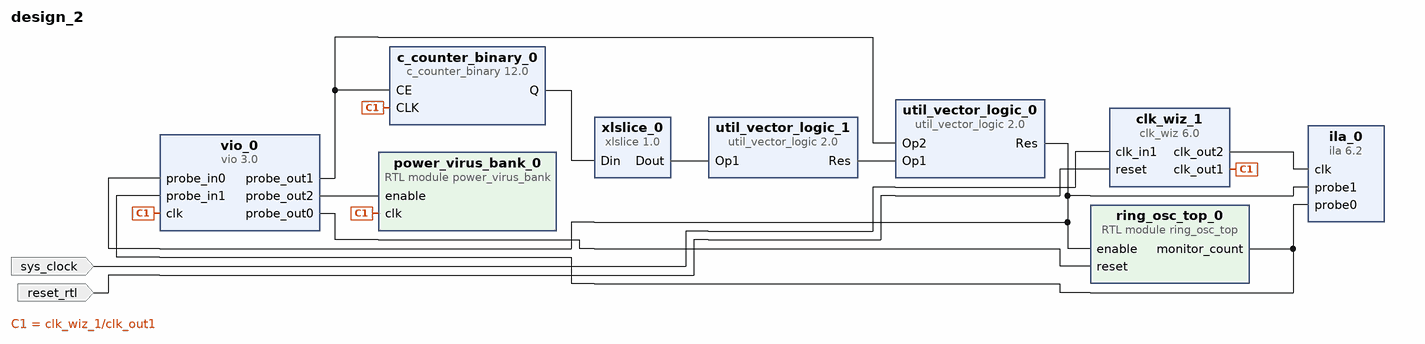
[diagram p0: block diagram of the top level]
# Vivado block design design_2, xc7z010clg400-1, Vivado 2020.1
create_bd_design design_2

create_bd_port -dir I -type clk sys_clock
set_property -dict {CONFIG.FREQ_HZ 125000000 CONFIG.PHASE 0.000} [get_bd_ports sys_clock]
create_bd_port -dir I -type rst reset_rtl
set_property -dict {CONFIG.POLARITY ACTIVE_HIGH} [get_bd_ports reset_rtl]

create_bd_cell -type ip -vlnv xilinx.com:ip:ila:6.2 ila_0
set_property -dict [list \
  CONFIG.C_ADV_TRIGGER true \
  CONFIG.C_DATA_DEPTH 65536 \
  CONFIG.C_ENABLE_ILA_AXI_MON false \
  CONFIG.C_MONITOR_TYPE Native \
  CONFIG.C_NUM_OF_PROBES 2 \
  CONFIG.C_PROBE0_TYPE 1 \
  CONFIG.C_PROBE0_WIDTH 24 \
] [get_bd_cells ila_0]
create_bd_cell -type ip -vlnv xilinx.com:ip:vio:3.0 vio_0
set_property -dict {CONFIG.C_NUM_PROBE_IN 2 CONFIG.C_NUM_PROBE_OUT 3 CONFIG.C_PROBE_OUT2_WIDTH 1} [get_bd_cells vio_0]
create_bd_cell -type ip -vlnv xilinx.com:ip:c_counter_binary:12.0 c_counter_binary_0
set_property -dict {CONFIG.CE true CONFIG.Final_Count_Value 20FF CONFIG.Restrict_Count true} [get_bd_cells c_counter_binary_0]
create_bd_cell -type ip -vlnv xilinx.com:ip:xlslice:1.0 xlslice_0
set_property -dict {CONFIG.DIN_FROM 13 CONFIG.DIN_TO 13 CONFIG.DIN_WIDTH 16 CONFIG.DOUT_WIDTH 1} [get_bd_cells xlslice_0]
create_bd_cell -type ip -vlnv xilinx.com:ip:util_vector_logic:2.0 util_vector_logic_0
set_property -dict {CONFIG.C_SIZE 1} [get_bd_cells util_vector_logic_0]
create_bd_cell -type ip -vlnv xilinx.com:ip:clk_wiz:6.0 clk_wiz_1
set_property -dict [list \
  CONFIG.CLKOUT1_JITTER 136.756 \
  CONFIG.CLKOUT1_PHASE_ERROR 122.096 \
  CONFIG.CLKOUT2_JITTER 249.501 \
  CONFIG.CLKOUT2_PHASE_ERROR 122.096 \
  CONFIG.CLKOUT2_REQUESTED_OUT_FREQ 5 \
  CONFIG.CLKOUT2_USED true \
  CONFIG.CLKOUT3_JITTER 147.112 \
  CONFIG.CLKOUT3_PHASE_ERROR 128.132 \
  CONFIG.CLKOUT3_USED false \
  CONFIG.CLK_IN1_BOARD_INTERFACE sys_clock \
  CONFIG.MMCM_CLKFBOUT_MULT_F 5.000 \
  CONFIG.MMCM_CLKIN2_PERIOD 10.0 \
  CONFIG.MMCM_CLKOUT0_DIVIDE_F 6.250 \
  CONFIG.MMCM_CLKOUT1_DIVIDE 125 \
  CONFIG.MMCM_CLKOUT2_DIVIDE 1 \
  CONFIG.NUM_OUT_CLKS 2 \
  CONFIG.USE_BOARD_FLOW true \
] [get_bd_cells clk_wiz_1]
create_bd_cell -type module -reference ring_osc_top ring_osc_top_0
create_bd_cell -type ip -vlnv xilinx.com:ip:util_vector_logic:2.0 util_vector_logic_1
set_property -dict {CONFIG.C_OPERATION not CONFIG.C_SIZE 1} [get_bd_cells util_vector_logic_1]
create_bd_cell -type module -reference power_virus_bank power_virus_bank_0

# ---- connections ----

connect_bd_net -net monitor_enable [get_bd_pins vio_0/probe_out1] [get_bd_pins c_counter_binary_0/CE] [get_bd_pins util_vector_logic_0/Op2]
connect_bd_net [get_bd_pins c_counter_binary_0/Q] [get_bd_pins xlslice_0/Din]
connect_bd_net [get_bd_pins clk_wiz_1/clk_out1] [get_bd_pins vio_0/clk] [get_bd_pins c_counter_binary_0/CLK] [get_bd_pins power_virus_bank_0/clk]
connect_bd_net -net count_enable [get_bd_pins util_vector_logic_0/Res] \
  [get_bd_pins vio_0/probe_in0] [get_bd_pins ila_0/probe1] [get_bd_pins ring_osc_top_0/enable]
connect_bd_net -net reset [get_bd_pins vio_0/probe_out0] [get_bd_pins ring_osc_top_0/reset]
connect_bd_net -net monitor_count [get_bd_pins ring_osc_top_0/monitor_count] [get_bd_pins ila_0/probe0] [get_bd_pins vio_0/probe_in1]
connect_bd_net [get_bd_ports sys_clock] [get_bd_pins clk_wiz_1/clk_in1]
connect_bd_net [get_bd_ports reset_rtl] [get_bd_pins clk_wiz_1/reset]
connect_bd_net [get_bd_pins clk_wiz_1/clk_out2] [get_bd_pins ila_0/clk]
connect_bd_net [get_bd_pins xlslice_0/Dout] [get_bd_pins util_vector_logic_1/Op1]
connect_bd_net [get_bd_pins util_vector_logic_1/Res] [get_bd_pins util_vector_logic_0/Op1]
connect_bd_net -net power_virus_enable [get_bd_pins vio_0/probe_out2] [get_bd_pins power_virus_bank_0/enable]

validate_bd_design
save_bd_design
